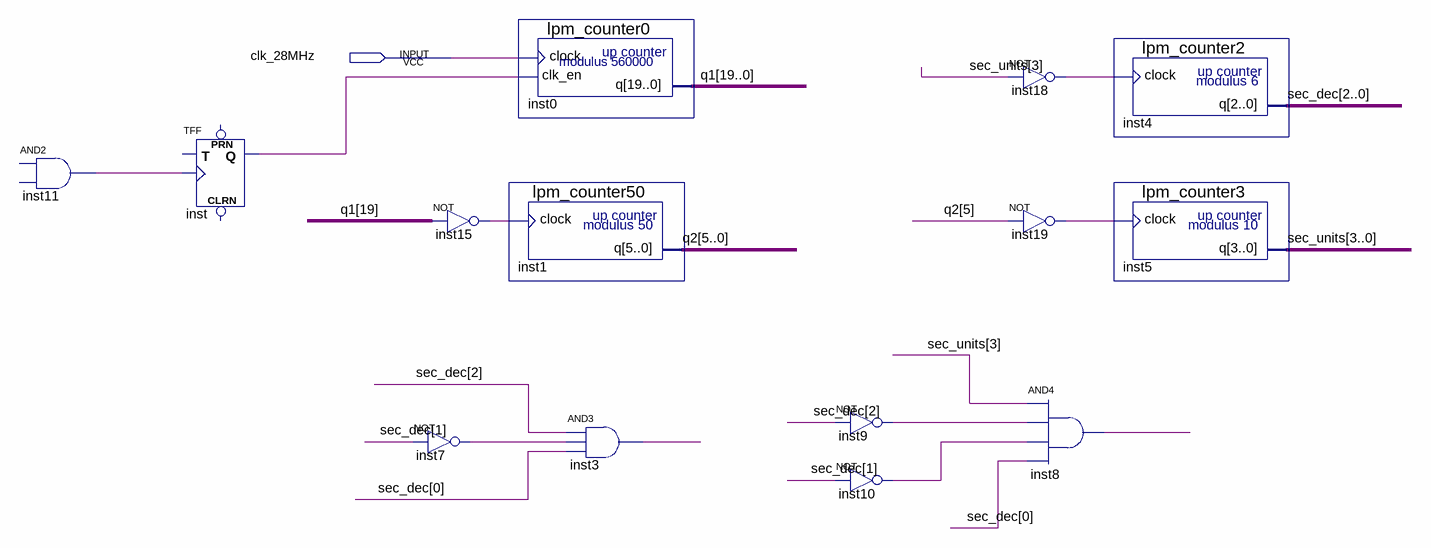
[diagram p0: schematic sheet]
// Quartus schematic contador_alarma.bdf as structural Verilog: 14 symbols, 1 pins
module contador_alarma (
  input  clk_28MHz
);

  wire inst3_out, inst7_out, inst8_out, inst9_out, inst10_out, inst11_out, inst15_out, inst18_out,
       inst19_out, inst_q;
  wire [2:0] sec_dec;
  wire [3:0] sec_units;
  wire [5:0] q2;
  wire [19:0] q1;

  // AND2 inst11 has open pins: IN1=open, IN2=open, OUT=inst11_out
  TFF inst (.CLK(inst11_out), .Q(inst_q));  // open: PRN, CLRN, T
  not inst15 (inst15_out, q1[19]);
  not inst7 (inst7_out, sec_dec[1]);
  lpm_counter0 inst0 (.clock(clk_28MHz), .clk_en(inst_q), .q(q1));
  lpm_counter50 inst1 (.clock(inst15_out), .q(q2));
  and inst3 (inst3_out, sec_dec[2], inst7_out, sec_dec[0]);
  not inst9 (inst9_out, sec_dec[2]);
  not inst10 (inst10_out, sec_dec[1]);
  not inst18 (inst18_out, sec_units[3]);
  not inst19 (inst19_out, q2[5]);
  and inst8 (inst8_out, sec_units[3], inst9_out, inst10_out, sec_dec[0]);
  lpm_counter2 inst4 (.clock(inst18_out), .q(sec_dec));
  lpm_counter3 inst5 (.clock(inst19_out), .q(sec_units));
endmodule
